# Altium schematic sheet TestPowerMergeSys.SchDoc
size C
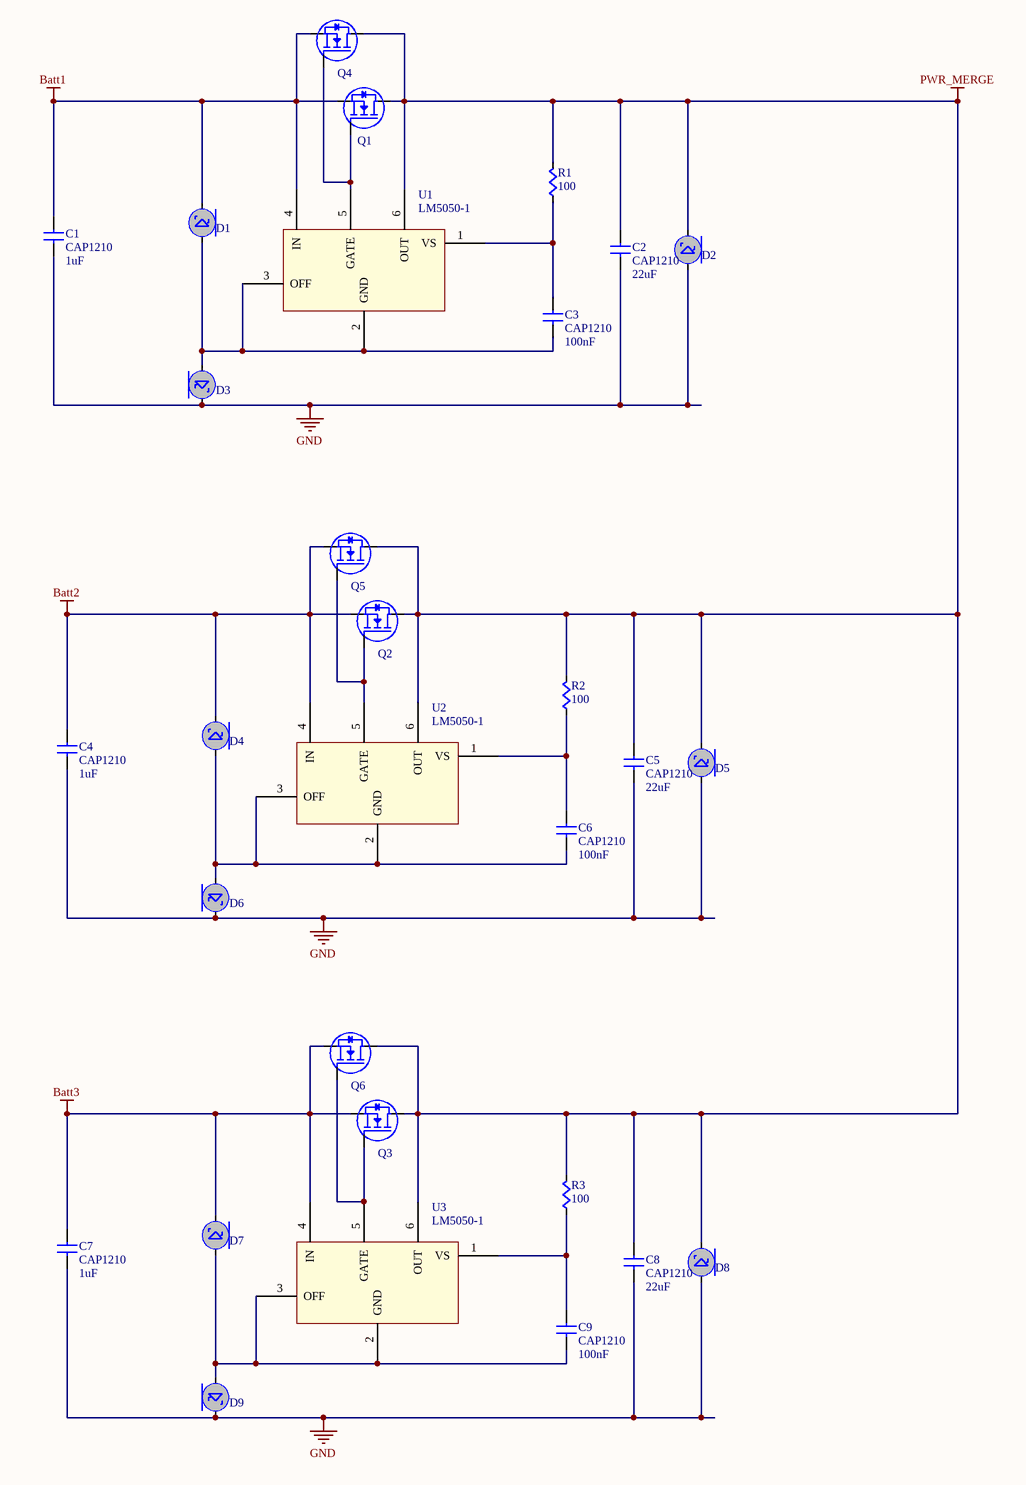
[diagram p0: TestPowerMergeSys.SchDoc]

## Parts
C1  CAP1210  value 1uF  [CAP1210]
C2  CAP1210  value 22uF  [CAP1210]
C3  CAP1210  value 100nF  [CAP1210]
C4  CAP1210  value 1uF  [CAP1210]
C5  CAP1210  value 22uF  [CAP1210]
C6  CAP1210  value 100nF  [CAP1210]
C7  CAP1210  value 1uF  [CAP1210]
C8  CAP1210  value 22uF  [CAP1210]
C9  CAP1210  value 100nF  [CAP1210]
D1  SS16T3G  [SS16T3G]  (value not drawn)
D2  SMBJ60A-13-F  [SMBJ60A-13-F]  (value not drawn)
D3  SS16T3G  [SS16T3G]  (value not drawn)
D4  SS16T3G  [SS16T3G]  (value not drawn)
D5  SMBJ60A-13-F  [SMBJ60A-13-F]  (value not drawn)
D6  SS16T3G  [SS16T3G]  (value not drawn)
D7  SS16T3G  [SS16T3G]  (value not drawn)
D8  SMBJ60A-13-F  [SMBJ60A-13-F]  (value not drawn)
D9  SS16T3G  [SS16T3G]  (value not drawn)
Q1  IRFB3306PbF  [TO-220AB Heatsink]  (value not drawn)
Q2  IRFB3306PbF  [TO-220AB Heatsink]  (value not drawn)
Q3  IRFB3306PbF  [TO-220AB Heatsink]  (value not drawn)
Q4  IRFB3306PbF  [TO-220AB Heatsink]  (value not drawn)
Q5  IRFB3306PbF  [TO-220AB Heatsink]  (value not drawn)
Q6  IRFB3306PbF  [TO-220AB Heatsink]  (value not drawn)
R1  value 100  [RES0603]  (hidden comment: Res)
R2  value 100  [RES0603]  (hidden comment: Res)
R3  value 100  [RES0603]  (hidden comment: Res)
U1  LM5050-1  [LM5050]
U2  LM5050-1  [LM5050]
U3  LM5050-1  [LM5050]

## Nets
Batt1: C1.1(A) D1.C Q1.S Q4.S U1.4(IN)
Batt2: C4.1(A) D4.C Q2.S Q5.S U2.4(IN)
Batt3: C7.1(A) D7.C Q3.S Q6.S U3.4(IN)
GND: C1.2(B) C2.2(B) C4.2(B) C5.2(B) C7.2(B) C8.2(B) D2.A D3.C D5.A D6.C D8.A D9.C
PWR_MERGE: C2.1(A) C5.1(A) C8.1(A) D2.C D5.C D8.C Q1.D Q2.D Q3.D Q4.D Q5.D Q6.D R1.1(A) R2.1(A) R3.1(A) U1.6(OUT) U2.6(OUT) U3.6(OUT)
NetC3_1: C3.1(A) R1.2(B) U1.1(VS)
NetC3_2: C3.2(B) D1.A D3.A U1.2(GND) U1.3(OFF)
NetC6_1: C6.1(A) R2.2(B) U2.1(VS)
NetC6_2: C6.2(B) D4.A D6.A U2.2(GND) U2.3(OFF)
NetC9_1: C9.1(A) R3.2(B) U3.1(VS)
NetC9_2: C9.2(B) D7.A D9.A U3.2(GND) U3.3(OFF)
NetQ1_G: Q1.G Q4.G U1.5(GATE)
NetQ2_G: Q2.G Q5.G U2.5(GATE)
NetQ3_G: Q3.G Q6.G U3.5(GATE)

## Library data of the parts
C1-C9 = CAP1210: CAP CER 10UF 50V 20% X5R 1210; Supplier 1: Digi-Key; Supplier Part Number 1: 587-2225-1-ND
D1 D3 D4 D6 D7 D9 = SS16T3G: DIODE SCHOTTKY 60V 1A SMA; Supplier 1: Digi-Key; Supplier Part Number 1: SS16T3GOSDKR-ND
D2 D5 D8 = SMBJ60A-13-F: TVS UNIDIRECT 600W 60V SMB; Supplier 1: Digi-Key; Supplier Part Number 1: SMBJ60A-FDIDKR-ND
Q1-Q6 = IRFx3306PbF: HEXFET Power MOSFET; Heatsink: A10755-ND; Supplier 1: Digi-Key; Supplier Part Number 1: IRFB3306PBF-ND
U1-U3 = LM5050: High-Side OR-ing FET Controller; Supplier 1: Digi-Key; Supplier Part Number 1: LM5050MK-1/NOPBCT-ND
R1-R3 = Res: Supplier 1: Digi-Key; Supplier Part Number 1: RMCF0603JT10K0CT-ND